# EAGLE schematic df2_redraw (EAGLE 9.6.2)
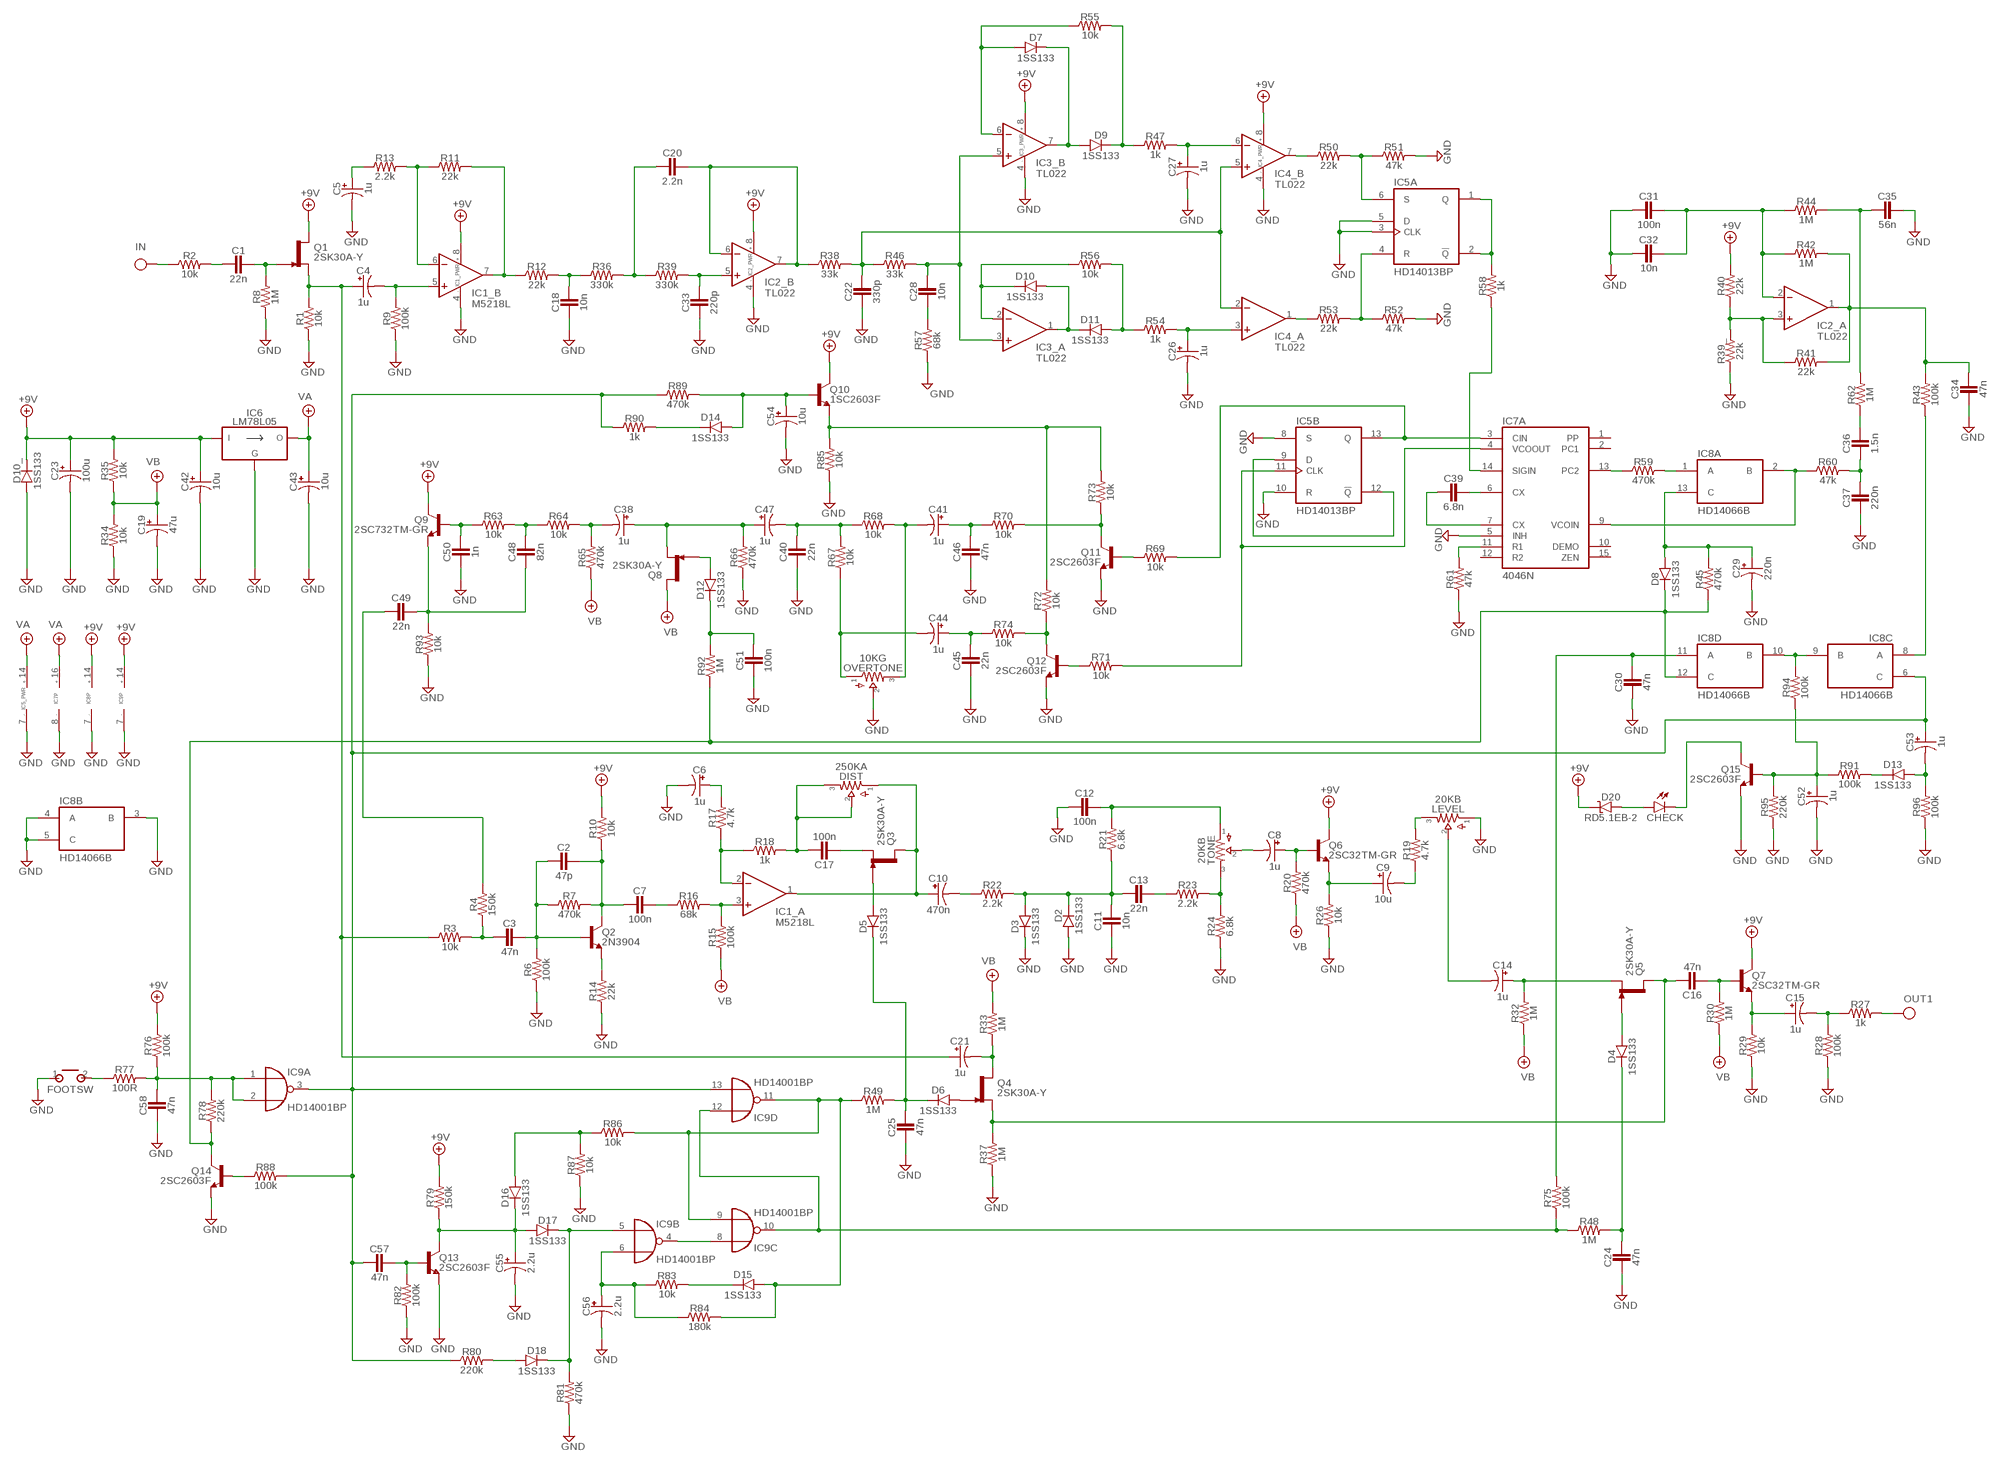
[diagram p0: schematic, sheet 1]

## Parts
C1  22n  CER/FILMBOX.1  [BOX_SMALL]
C2  47p  CER/FILMBOX.1  [BOX_SMALL]
C3  47n  CER/FILMBOX.1  [BOX_SMALL]
C4  1u  0400  [040_020]
C5  1u  0400  [040_020]
C6  1u  0400  [040_020]
C7  100n  CER/FILMBOX.1  [BOX_SMALL]
C8  1u  0400  [040_020]
C9  10u  0400  [040_020]
C10  470n  0400  [040_020]
C11  10n  CER/FILMBOX.1  [BOX_SMALL]
C12  100n  CER/FILMBOX.1  [BOX_SMALL]
C13  22n  CER/FILMBOX.1  [BOX_SMALL]
C14  1u  0400  [040_020]
C15  1u  0400  [040_020]
C16  47n  CER/FILMBOX.1  [BOX_SMALL]
C17  100n  CER/FILMBOX.1  [BOX_SMALL]
C18  10n  CER/FILMBOX.1  [BOX_SMALL]
C19  47u  0400  [040_020]
C20  2.2n  CER/FILMBOX.1  [BOX_SMALL]
C21  1u  0400  [040_020]
C22  330p  CER/FILMBOX.1  [BOX_SMALL]
C23  100u  0400  [040_020]
C24  47n  CER/FILMBOX.1  [BOX_SMALL]
C25  47n  CER/FILMBOX.1  [BOX_SMALL]
C26  1u  0400  [040_020]
C27  1u  0400  [040_020]
C28  10n  CER/FILMBOX.1  [BOX_SMALL]
C29  220n  0400  [040_020]
C30  47n  CER/FILMBOX.1  [BOX_SMALL]
C31  100n  CER/FILMBOX.1  [BOX_SMALL]
C32  10n  CER/FILMBOX.1  [BOX_SMALL]
C33  220p  CER/FILMBOX.1  [BOX_SMALL]
C34  47n  CER/FILMBOX.1  [BOX_SMALL]
C35  56n  CER/FILMBOX.1  [BOX_SMALL]
C36  1.5n  CER/FILMBOX.1  [BOX_SMALL]
C37  220n  CER/FILMBOX.1  [BOX_SMALL]
C38  1u  0400  [040_020]
C39  6.8n  CER/FILMBOX.1  [BOX_SMALL]
C40  22n  CER/FILMBOX.1  [BOX_SMALL]
C41  1u  0400  [040_020]
C42  10u  0400  [040_020]
C43  10u  0400  [040_020]
C44  1u  0400  [040_020]
C45  22n  CER/FILMBOX.1  [BOX_SMALL]
C46  47n  CER/FILMBOX.1  [BOX_SMALL]
C47  1u  0400  [040_020]
C48  82n  CER/FILMBOX.1  [BOX_SMALL]
C49  22n  CER/FILMBOX.1  [BOX_SMALL]
C50  1n  CER/FILMBOX.1  [BOX_SMALL]
C51  100n  CER/FILMBOX.1  [BOX_SMALL]
C52  1u  0400  [040_020]
C53  1u  0400  [040_020]
C54  10u  0400  [040_020]
C55  2.2u  0400  [040_020]
C56  2.2u  0400  [040_020]
C57  47n  CER/FILMBOX.1  [BOX_SMALL]
C58  47n  CER/FILMBOX.1  [BOX_SMALL]
CHECK  LED  [3MM_D]
D2  1SS133  DO35.2  [DO35-2]
D3  1SS133  DO35.2  [DO35-2]
D4  1SS133  DO35.2  [DO35-2]
D5  1SS133  DO35.2  [DO35-2]
D6  1SS133  DO35.2  [DO35-2]
D7  1SS133  DO35.2  [DO35-2]
D8  1SS133  DO35.2  [DO35-2]
D9  1SS133  DO35.2  [DO35-2]
D10  1SS133  DO35.2  [DO35-2]
D10_  1SS133  DO35.2  [DO35-2]
D11  1SS133  DO35.2  [DO35-2]
D12  1SS133  DO35.2  [DO35-2]
D13  1SS133  DO35.2  [DO35-2]
D14  1SS133  DO35.2  [DO35-2]
D15  1SS133  DO35.2  [DO35-2]
D16  1SS133  DO35.2  [DO35-2]
D17  1SS133  DO35.2  [DO35-2]
D18  1SS133  DO35.2  [DO35-2]
D20  RD5.1EB-2  ZENER.2  [DO41-2]
DIST  250KA  POTS  [16MM_CENTERMOUNT]
FOOTSW  MOMENTARY  [SPST]
IC1  M5218L  DUALTH  [DIL0]
IC2  TL022  DUALTH  [DIL0]
IC3  TL022  DUALTH  [DIL0]
IC4  TL022  DUALTH  [DIL0]
IC5  HD14013BP  4013N  [DIL14]
IC6  LM78L05  [TO92-]
IC7  4046N  [DIL16]
IC8  HD14066B  4066N  [DIL14]
IC9  HD14001BP  4001N  [DIL14]
LEVEL  20KB  POTS  [16MM_CENTERMOUNT]
OVERTONE  10KG  POTS  [16MM_CENTERMOUNT]
Q1  2SK30A-Y  2SK30A  [TO92-]
Q2  2N3904  [TO92-]
Q3  2SK30A-Y  2SK30A  [TO92-]
Q4  2SK30A-Y  2SK30A  [TO92-]
Q5  2SK30A-Y  2SK30A  [TO92-]
Q6  2SC32TM-GR  2N3904  [TO92-]
Q7  2SC32TM-GR  2N3904  [TO92-]
Q8  2SK30A-Y  2SK30A  [TO92-]
Q9  2SC732TM-GR  2N3904  [TO92-]
Q10  1SC2603F  2N3904  [TO92-]
Q11  2SC2603F  2N3904  [TO92-]
Q12  2SC2603F  2N3904  [TO92-]
Q13  2SC2603F  2N3904  [TO92-]
Q14  2SC2603F  2N3904  [TO92-]
Q15  2SC2603F  2N3904  [TO92-]
R1  10k  R_.3B  [R0207/3]
R2  10k  R_.3B  [R0207/3]
R3  10k  R_.3B  [R0207/3]
R4  150k  R_.3B  [R0207/3]
R6  100k  R_.3B  [R0207/3]
R7  470k  R_.3B  [R0207/3]
R8  1M  R_.3B  [R0207/3]
R9  100k  R_.3B  [R0207/3]
R10  10k  R_.3B  [R0207/3]
R11  22k  R_.3B  [R0207/3]
R12  22k  R_.3B  [R0207/3]
R13  2.2k  R_.3B  [R0207/3]
R14  22k  R_.3B  [R0207/3]
R15  100k  R_.3B  [R0207/3]
R16  68k  R_.3B  [R0207/3]
R17  4.7k  R_.3B  [R0207/3]
R18  1k  R_.3B  [R0207/3]
R19  4.7k  R_.3B  [R0207/3]
R20  470k  R_.3B  [R0207/3]
R21  6.8k  R_.3B  [R0207/3]
R22  2.2k  R_.3B  [R0207/3]
R23  2.2k  R_.3B  [R0207/3]
R24  6.8k  R_.3B  [R0207/3]
R26  10k  R_.3B  [R0207/3]
R27  1k  R_.3B  [R0207/3]
R28  100k  R_.3B  [R0207/3]
R29  10k  R_.3B  [R0207/3]
R30  1M  R_.3B  [R0207/3]
R32  1M  R_.3B  [R0207/3]
R33  1M  R_.3B  [R0207/3]
R34  10k  R_.3B  [R0207/3]
R35  10k  R_.3B  [R0207/3]
R36  330k  R_.3B  [R0207/3]
R37  1M  R_.3B  [R0207/3]
R38  33k  R_.3B  [R0207/3]
R39  330k  R_.3B  [R0207/3]
R39_  22k  R_.3B  [R0207/3]
R40  22k  R_.3B  [R0207/3]
R41  22k  R_.3B  [R0207/3]
R42  1M  R_.3B  [R0207/3]
R43  100k  R_.3B  [R0207/3]
R44  1M  R_.3B  [R0207/3]
R45  470k  R_.3B  [R0207/3]
R46  33k  R_.3B  [R0207/3]
R47  1k  R_.3B  [R0207/3]
R48  1M  R_.3B  [R0207/3]
R49  1M  R_.3B  [R0207/3]
R50  22k  R_.3B  [R0207/3]
R51  47k  R_.3B  [R0207/3]
R52  47k  R_.3B  [R0207/3]
R53  22k  R_.3B  [R0207/3]
R54  1k  R_.3B  [R0207/3]
R55  10k  R_.3B  [R0207/3]
R56  10k  R_.3B  [R0207/3]
R57  68k  R_.3B  [R0207/3]
R58  1k  R_.3B  [R0207/3]
R59  470k  R_.3B  [R0207/3]
R60  47k  R_.3B  [R0207/3]
R61  47k  R_.3B  [R0207/3]
R62  1M  R_.3B  [R0207/3]
R63  10k  R_.3B  [R0207/3]
R64  10k  R_.3B  [R0207/3]
R65  470k  R_.3B  [R0207/3]
R66  470k  R_.3B  [R0207/3]
R67  10k  R_.3B  [R0207/3]
R68  10k  R_.3B  [R0207/3]
R69  10k  R_.3B  [R0207/3]
R70  10k  R_.3B  [R0207/3]
R71  10k  R_.3B  [R0207/3]
R72  10k  R_.3B  [R0207/3]
R73  10k  R_.3B  [R0207/3]
R74  10k  R_.3B  [R0207/3]
R75  100k  R_.3B  [R0207/3]
R76  100k  R_.3B  [R0207/3]
R77  100R  R_.3B  [R0207/3]
R78  220k  R_.3B  [R0207/3]
R79  150k  R_.3B  [R0207/3]
R80  220k  R_.3B  [R0207/3]
R81  470k  R_.3B  [R0207/3]
R82  100k  R_.3B  [R0207/3]
R83  10k  R_.3B  [R0207/3]
R84  180k  R_.3B  [R0207/3]
R85  10k  R_.3B  [R0207/3]
R86  10k  R_.3B  [R0207/3]
R87  10k  R_.3B  [R0207/3]
R88  100k  R_.3B  [R0207/3]
R89  470k  R_.3B  [R0207/3]
R90  1k  R_.3B  [R0207/3]
R91  100k  R_.3B  [R0207/3]
R92  1M  R_.3B  [R0207/3]
R93  10k  R_.3B  [R0207/3]
R94  100k  R_.3B  [R0207/3]
R95  220k  R_.3B  [R0207/3]
R96  100k  R_.3B  [R0207/3]
TONE  20KB  POTS  [16MM_CENTERMOUNT]

## Nets
+9V: C23.+ C42.+ D10_.C D20.C IC1.8(_PWR:V+) IC2.8(_PWR:V+) IC3.8(_PWR:V+) IC4.8(_PWR:V+) IC6.1(VI) IC8.14(P:VDD) IC9.14(P:VDD) Q1.1(D) Q6.1(C) Q7.1(C) Q9.1(C) Q10.1(C) R10.2 R35.2 R40.2 R76.2 R79.2
GND: C5.- C6.- C11.2 C12.2 C18.2 C19.- C22.2 C23.- C24.2 C25.2 C26.- C27.- C29.- C30.2 C31.2 C32.2 C33.2 C34.2 C35.1 C37.2 C40.2 C42.- C43.- C45.2 C46.2 C50.2 C51.2 C52.- C54.- C55.- C56.- C58.2 D2.A D3.C D10_.A FOOTSW.1(P) IC1.4(_PWR:V-) IC2.4(_PWR:V-) IC3.4(_PWR:V-) IC4.4(_PWR:V-) IC5.3(A:CLK) IC5.5(A:D) IC5.7(_PWR:VSS) IC5.8(B:S) IC5.10(B:R) IC6.2(GND) IC7.5(A:INH) IC7.8(P:VSS) IC8.3(B:B) IC8.4(B:A) IC8.5(B:C) IC8.7(P:VSS) IC9.7(P:VSS) LEVEL.1 OVERTONE.2 Q11.3(E) Q12.3(E) Q13.3(E) Q14.3(E) Q15.3(E) R1.1 R6.1 R8.1 R9.1 R14.1 R24.1 R26.1 R28.1 R29.1 R34.1 R37.1 R39_.1 R51.2 R52.2 R57.1 R61.1 R66.1 R81.1 R82.1 R85.1 R87.1 R93.1 R95.1 R96.1
IN: R2.1
N$1: C1.1 Q1.2(G) R8.2
N$2: C4.+ C21.+ Q1.3(S) R1.2 R3.1
N$3: C1.2 R2.2
N$4: C4.- IC1.5(_B:+IN) R9.2
N$5: C5.+ R13.1
N$6: IC1.6(_B:-IN) R11.1 R13.2
N$7: IC1.7(_B:OUT) R11.2 R12.1
N$8: C18.1 R12.2 R36.1
N$9: C20.2 R36.2 R39.1
N$10: C33.1 IC2.5(_B:+IN) R39.2
N$11: C20.1 IC2.6(_B:-IN) IC2.7(_B:OUT) R38.1
N$12: D7.A IC3.6(_B:-IN) R55.1
N$13: C22.1 IC4.2(_A:-IN) IC4.5(_B:+IN) R38.2 R46.1
N$14: C28.1 IC3.3(_A:+IN) IC3.5(_B:+IN) R46.2
N$15: C28.2 R57.2
N$16: D10.C IC3.2(_A:-IN) R56.1
N$17: D10.A D11.C IC3.1(_A:OUT)
N$18: D11.A R54.1 R56.2
N$19: D7.C D9.A IC3.7(_B:OUT)
N$20: D9.C R47.1 R55.2
N$21: C39.1 IC7.6(A:CX)
N$22: D13.C R91.2
N$23: C26.+ IC4.3(_A:+IN) R54.2
N$24: IC4.7(_B:OUT) R50.1
N$25: IC5.6(A:S) R50.2 R51.1
N$26: IC4.1(_A:OUT) R53.1
N$27: IC5.4(A:R) R52.1 R53.2
N$28: IC5.1(A:Q) IC5.2(A:!Q) R58.2
N$29: D14.C R90.2
N$30: IC5.9(B:D) IC5.12(B:!Q)
N$31: C39.2 IC7.7(A:CX)
N$32: IC7.11(A:R1) R61.2
N$33: IC5.13(B:Q) IC7.3(A:CIN) R69.2
N$34: IC5.11(B:CLK) IC7.4(A:VCOOUT) R71.2
N$35: C31.1 C32.1 IC2.2(_A:-IN) R42.1 R44.1
N$36: IC7.13(A:PC2) R59.1
N$37: IC8.1(A:A) R59.2
N$38: IC7.9(A:VCOIN) IC8.2(A:B) R60.1
N$39: C34.1 IC2.1(_A:OUT) R41.2 R42.2 R43.2
N$40: IC2.3(_A:+IN) R39_.2 R40.1 R41.1
N$41: C36.2 C37.1 R60.2
N$42: C36.1 R62.1
N$43: C35.2 R44.2 R62.2
N$44: IC8.9(C:B) IC8.10(D:B) R94.2
N$45: IC8.8(C:A) R43.1
N$46: C29.+ D8.A IC8.13(A:C) R45.2
N$47: D8.C IC8.12(D:C) Q14.1(C) R45.1 R78.1 R92.1
N$48: Q12.2(B) R71.1
N$49: C30.1 IC8.11(D:A) R75.2
N$50: IC7.14(A:SIGIN) R58.1
N$51: Q12.1(C) R72.1 R74.2
N$52: Q11.2(B) R69.1
N$53: Q11.1(C) R70.2 R73.1
N$54: C54.+ D14.A Q10.2(B) R89.2
N$55: C41.+ C46.1 R70.1
N$56: C44.+ C45.1 R74.1
N$57: C44.- OVERTONE.1 R67.1
N$58: C40.1 C47.- R67.2 R68.1
N$59: C41.- OVERTONE.3 R68.2
N$60: C38.+ C47.+ Q8.3(S) R66.2
N$61: Q10.3(E) R72.2 R73.2 R85.2
N$62: D12.A Q8.2(G)
N$63: C51.1 D12.C R92.2
N$64: C38.- R64.2 R65.2
N$65: C53.+ C57.2 IC8.6(C:C) IC9.3(A:O) IC9.13(D:I1) R80.1 R88.2 R89.1 R90.1
N$66: IC9.10(C:O) IC9.12(D:I0) R48.1 R75.1
N$67: C48.1 R63.2 R64.1
N$68: C50.1 Q9.2(B) R63.1
N$69: C48.2 C49.1 Q9.3(E) R93.2
N$70: C53.- D13.A R96.2
N$72: C52.+ Q15.2(B) R91.1 R94.1 R95.2
N$73: C7.1 R16.1
N$74: C55.+ D16.C D17.A Q13.1(C) R79.1
N$75: C3.2 R3.2 R4.1
N$76: C2.2 C3.1 Q2.2(B) R6.2 R7.1
N$77: Q2.3(E) R14.2
N$78: C2.1 C7.2 Q2.1(C) R7.2 R10.1
N$79: IC1.3(_A:+IN) R15.2 R16.2
N$80: C6.+ R17.2
N$81: IC1.2(_A:-IN) R17.1 R18.1
N$82: C17.1 DIST.2 DIST.3 R18.2
N$83: D5.A Q3.2(G)
N$84: C10.- R22.1
N$85: C17.2 Q3.3(S)
N$86: C10.+ DIST.1 IC1.1(_A:OUT) Q3.1(D)
N$87: C11.1 C13.2 D2.C D3.A R21.1 R22.2
N$88: C8.- TONE.2
N$89: C13.1 R23.1
N$90: R23.2 R24.2 TONE.3
N$91: C12.1 R21.2 TONE.1
N$92: C8.+ Q6.2(B) R20.2
N$93: C9.+ Q6.3(E) R26.2
N$94: C9.- R19.1
N$95: LEVEL.3 R19.2
N$96: C14.- LEVEL.2
N$97: CHECK.ANODE(A) D20.A
N$98: CHECK.P$1(C) Q15.1(C)
N$99: FOOTSW.2(S) R77.1
N$100: C58.1 IC9.1(A:I0) IC9.2(A:I1) R76.1 R77.2 R78.2
N$101: C57.1 Q13.2(B) R82.2
N$102: Q14.2(B) R88.1
N$103: D18.A R80.2
N$104: C49.2 R4.2
N$105: D17.C D18.C IC9.5(B:I0) R81.2
N$106: C56.+ IC9.6(B:I1) R83.1 R84.1
N$107: D15.C R83.2
N$108: D15.A IC9.9(C:I1) IC9.11(D:O) R49.1 R84.2 R86.2
N$109: IC9.4(B:O) IC9.8(C:I0)
N$110: D16.A R86.1 R87.2
N$111: C25.1 D5.C D6.C R49.2
N$113: D6.A Q4.2(G)
N$114: C21.- Q4.1(D) R33.1
N$115: C24.1 D4.C R48.2
N$116: D4.A Q5.2(G)
N$117: C14.+ Q5.3(S) R32.2
N$118: C16.1 Q4.3(S) Q5.1(D) R37.2
N$119: C16.2 Q7.2(B) R30.2
N$120: C15.+ Q7.3(E) R29.2
N$121: C15.- R27.1 R28.2
OUT: R27.2
R47: C27.+ IC4.6(_B:-IN) R47.2
VA: C43.+ IC5.14(_PWR:VDD) IC6.3(VO) IC7.16(P:VDD)
VB: C19.+ Q8.1(D) R15.1 R20.1 R30.1 R32.1 R33.2 R34.2 R35.1 R65.1
Unconnected: IC7.1(A:PP) IC7.2(A:PC1) IC7.10(A:DEMO) IC7.12(A:R2) IC7.15(A:ZEN)

## Library data of the parts
C1-C3 C7 C11-C13 C16-C18 C20 C22 C24 C25 C28 C30-C37 C39 C40 C45 C46 C48-C51 C57 C58 = pedals-capacitors-film:CER/FILM: 47 - 120pF Xicon Ceramic Disc 2.5mm lead spacing
C4-C6 C8-C10 C14 C15 C19 C21 C23 C26 C27 C29 C38 C41-C44 C47 C52-C56 = pedals-capacitors-elec:040
CHECK = pedals-diodes:LED
D2-D10 D10_ D11-D18 = pedals-diodes:DO35: DO-35 Package Diodes: 1N914
D20 = pedals-diodes:ZENER
DIST LEVEL OVERTONE TONE = pedals-potentiometers:POTS
FOOTSW = pedals-switches:MOMENTARY
IC1-IC4 = pedals-integrated circuits:DUAL: OP AMP
IC5 = pedals-40xx-2:4013: Dual D FLIP FLOP, set/reset
IC6 = pedals-regulators:LM78L05
IC7 = pedals-40xx-2:4046: Micropower PLL
IC8 = pedals-40xx-2:4066: Quad bilateral ANALOG SWITCH
IC9 = pedals-40xx-2:4001: Quad 2-input NOR
Q1 Q3-Q5 Q8 = pedals-transistors:2SK30A
Q2 Q6 Q7 Q9-Q15 = pedals-transistors:2N3904: NPN Transistor
R1-R4 R6-R24 R26-R30 R32-R39 R39_ R40-R96 = pedals-resistors:R_